# Altium schematic sheet Cover Page.SchDoc: COVER PAGE
size A4; Organization: Minbiocabanon Corp.; Address2: Kiwi road; Address3: TOULOUSE; Address4: FRANCE; DocumentNumber: 2; SheetNumber: 2; SheetTotal: 5
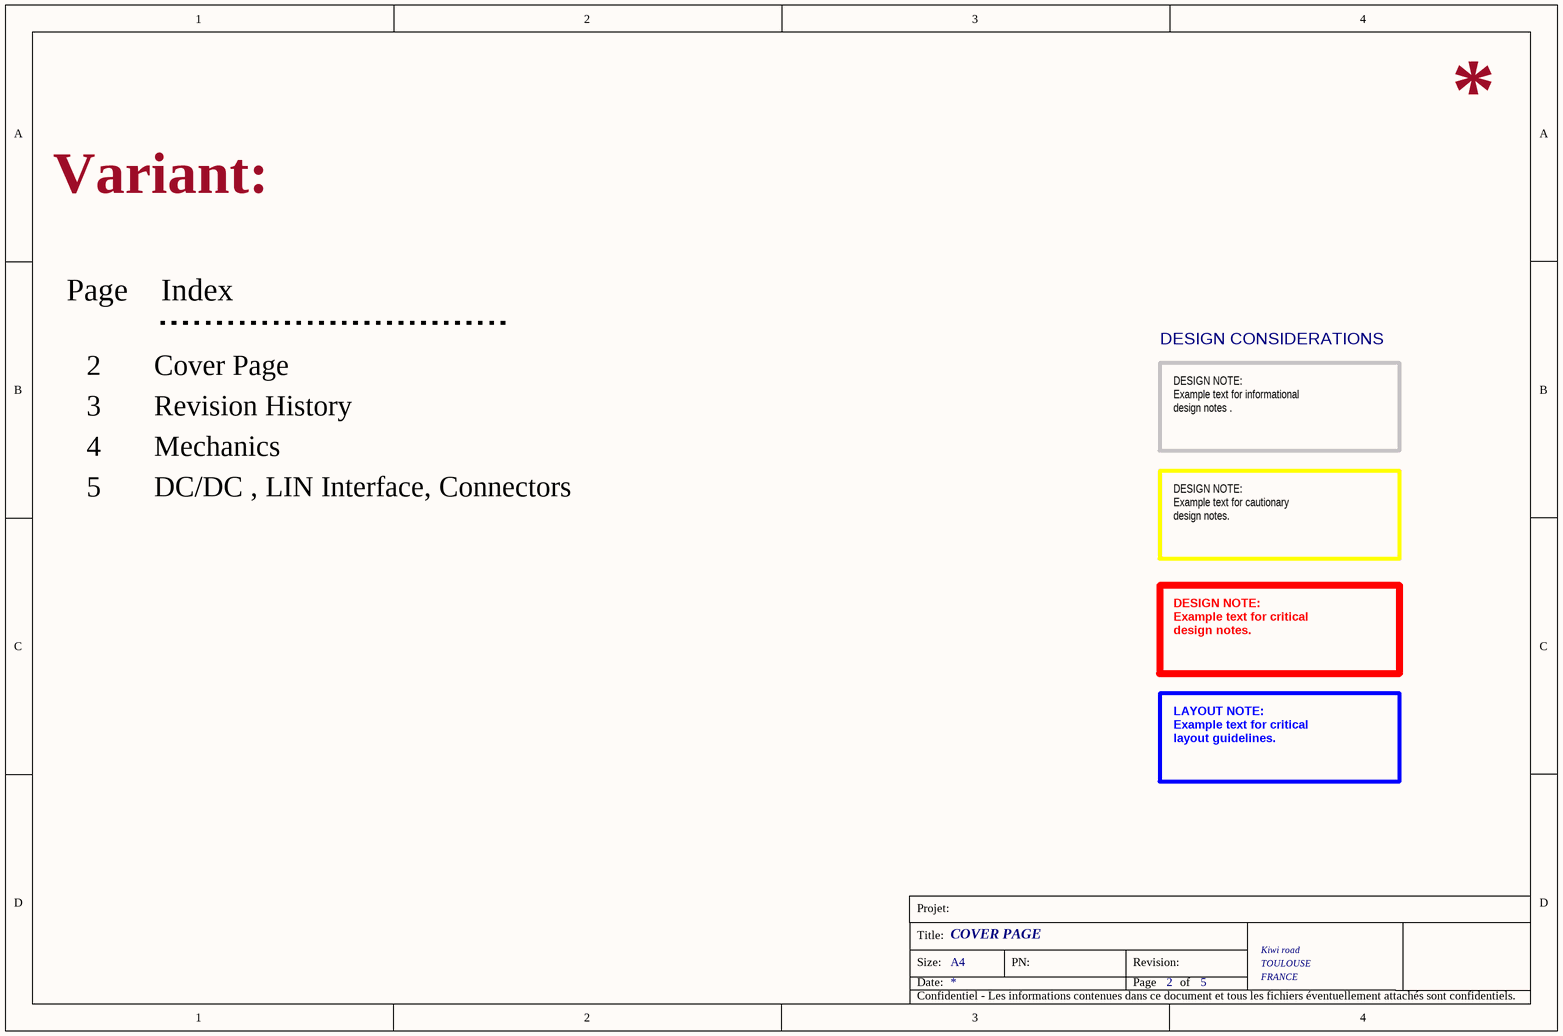
[diagram p0: Cover Page.SchDoc]

## Notes on the sheet
- Variant:
- Page
- Index
- 2
- Cover Page
- DESIGN CONSIDERATIONS
- 3
- Revision History
- DESIGN NOTE:
  Example text for informational
  design notes .
- 4
- 5
- Mechanics
- DC/DC , LIN Interface, Connectors
- DESIGN NOTE:
  Example text for cautionary
  design notes.
- DESIGN NOTE:
  Example text for critical
  design notes.
- LAYOUT NOTE:
  Example text for critical
  layout guidelines.
- Projet:
- Title:
- Size:
- Date:
- A4
- PN:
- Revision:
- of
- Confidentiel - Les informations contenues dans ce document et tous les fichiers éventuellement attachés sont confidentiels.